# Altium schematic sheet INTERNAL_REGULATORS.SchDoc
size B; SheetNumber: 5; SheetTotal: 5
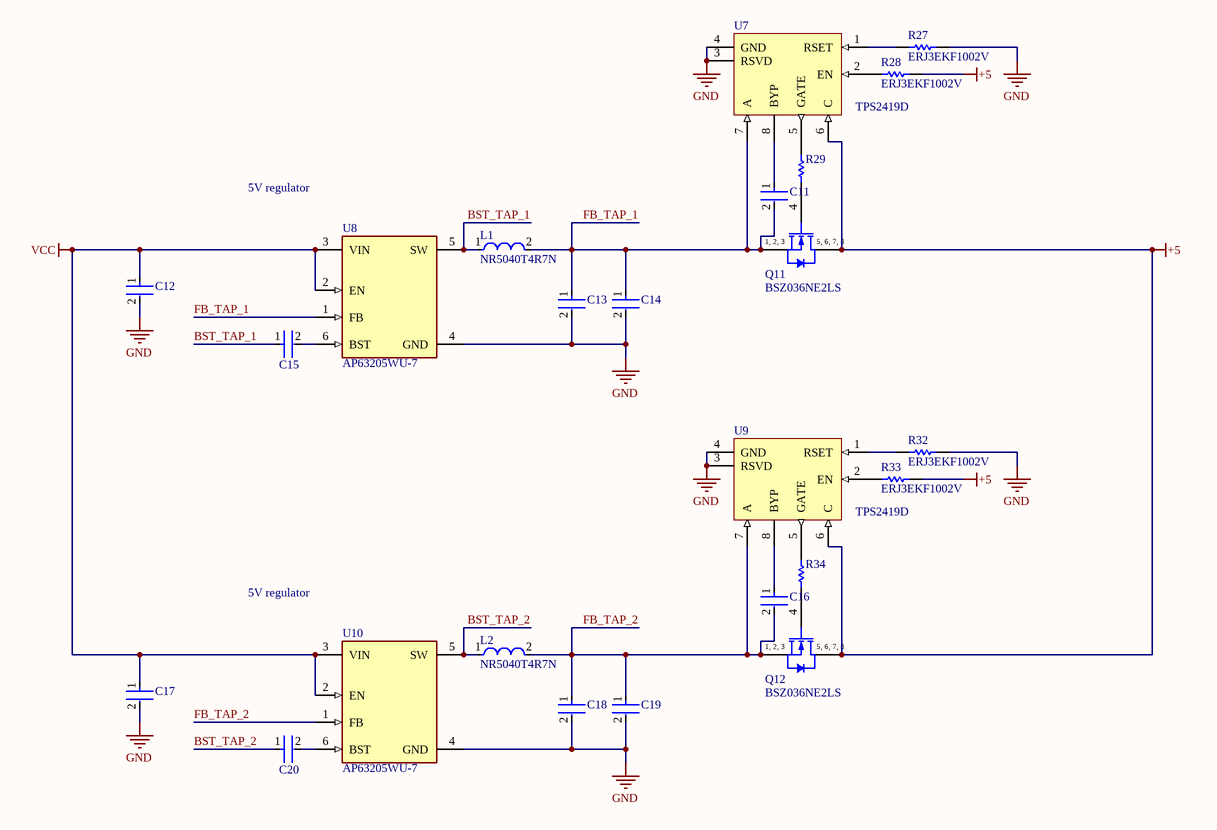
[diagram p0: INTERNAL_REGULATORS.SchDoc]

## Parts
C11  08055C222JAT2A  [FP-0805-L_2_01_0_2-W_1_25-IPC_C]  (value not drawn)
C12  C0805C106K8PACTU  [FP-C0805C-DG-MFG]  (value not drawn)
C13  GRM21BR61E226ME44L  [FP-GRM21B-0_2-e0_2_0_7-IPC_B]  (value not drawn)
C14  GRM21BR61E226ME44L  [FP-GRM21B-0_2-e0_2_0_7-IPC_B]  (value not drawn)
C15  C0402C104K8PACTU  [FP-C0402-BB-MFG]  (value not drawn)
C16  08055C222JAT2A  [FP-0805-L_2_01_0_2-W_1_25-IPC_C]  (value not drawn)
C17  C0805C106K8PACTU  [FP-C0805C-DG-MFG]  (value not drawn)
C18  GRM21BR61E226ME44L  [FP-GRM21B-0_2-e0_2_0_7-IPC_B]  (value not drawn)
C19  GRM21BR61E226ME44L  [FP-GRM21B-0_2-e0_2_0_7-IPC_B]  (value not drawn)
C20  C0402C104K8PACTU  [FP-C0402-BB-MFG]  (value not drawn)
L1  NR5040T4R7N  [FP-NR5040-H_4_1-MFG]
L2  NR5040T4R7N  [FP-NR5040-H_4_1-MFG]
Q11  BSZ036NE2LS  [INF-PG-TSDSON-8_FL_V]
Q12  BSZ036NE2LS  [INF-PG-TSDSON-8_FL_V]
R27  ERJ3EKF1002V  [RESC1609X55X30LL15T15]
R28  ERJ3EKF1002V  [RESC1609X55X30LL15T15]
R29  ERJ3EKF51R0V  [RESC1608X55X30NL15T15]  (value not drawn)
R32  ERJ3EKF1002V  [RESC1609X55X30LL15T15]
R33  ERJ3EKF1002V  [RESC1609X55X30LL15T15]
R34  ERJ3EKF51R0V  [RESC1608X55X30NL15T15]  (value not drawn)
U7  TPS2419D  [D0008A_N]
U8  AP63205WU-7  [FP-TSOT26-MFG]
U9  TPS2419D  [D0008A_N]
U10  AP63205WU-7  [FP-TSOT26-MFG]

## Nets
+5: Q11.5(DRAIN) Q11.6(DRAIN) Q11.7(DRAIN) Q11.8(DRAIN) Q12.5(DRAIN) Q12.6(DRAIN) Q12.7(DRAIN) Q12.8(DRAIN) R28.1 R33.1 U7.6(C) U9.6(C)
GND: C12.2 C13.2 C14.2 C17.2 C18.2 C19.2 R27.1 R32.1 U7.3(RSVD) U7.4(GND) U8.4(GND) U9.3(RSVD) U9.4(GND) U10.4(GND)
VCC: C12.1 C17.1 U8.2(EN) U8.3(VIN) U10.2(EN) U10.3(VIN)
BST_TAP_1: C15.1 L1.1 U8.5(SW)
BST_TAP_2: C20.1 L2.1 U10.5(SW)
FB_TAP_1: C11.2 C13.1 C14.1 L1.2 Q11.1(SOURCE) Q11.2(SOURCE) Q11.3(SOURCE) U7.7(A) U8.1(FB)
FB_TAP_2: C16.2 C18.1 C19.1 L2.2 Q12.1(SOURCE) Q12.2(SOURCE) Q12.3(SOURCE) U9.7(A) U10.1(FB)
NetC11_1: C11.1 U7.8(BYP)
NetC15_2: C15.2 U8.6(BST)
NetC16_1: C16.1 U9.8(BYP)
NetC20_2: C20.2 U10.6(BST)
NetQ11_4: Q11.4(GATE) R29.1
NetQ12_4: Q12.4(GATE) R34.1
NetR27_2: R27.2 U7.1(RSET)
NetR28_2: R28.2 U7.2(EN)
NetR29_2: R29.2 U7.5(GATE)
NetR32_2: R32.2 U9.1(RSET)
NetR33_2: R33.2 U9.2(EN)
NetR34_2: R34.2 U9.5(GATE)

## Notes on the sheet
- 5V regulator
- (in symbol CMP-1090-00125-1) 1, 2, 3; 5, 6, 7, 8

## Library data of the parts
C11 C16 = CMP-2007-04392-2: General Purpose Ceramic Capacitor, 0805, 2.2nF, 5%, X7R, 0.15, 50V; Min Operating Temperature: -55°C; Max Operating Temperature: 125°C; Construction: Flat; Voltage Rating (DC): 50V; Series: -; Case Code (Imperial): 0805; Width: 0.049inch; Mount: Surface Mount; Package Quantity: 4000; Packaging: Tape and Reel; Termination: SMD/SMT; Tolerance: 5%; Number of Pins: 2; Depth: 1.25mm; Lead Free: Lead Free; REACH SVHC: No SVHC; Contact Plating: Tin; Length: 2.01mm; Radiation Hardening: No; Capacitance: 2.2nF; Lead Pitch: 5.08mm; Thickness: 0.037inch; Dielectric: X7R; RoHS Compliant: Yes; Voltage Rating: 50V; Case Code (Metric): 2012; Height: 0.94mm; Case/Package: 0805
C12 C17 = CMP-2007-03243-2: CAP CER 10UF 10V X5R 0805; Manufacturer: Kemet; 3DS Part Number: 220-00001; Tolerance: 10%; Temperature Coefficient: 15%; Material: Ceramic; Device Class L2: Capacitors; Device Class L1: Passive Components; ComponentLink2URL: https://content.kemet.com/datasheets/KEM_C1006_X5R_SMD.pdf; Height: 1.4mm; Lead Free: Yes; Manufacturer Part Number: C0805C106K8PACTU; Digikey Description: CAP CER 10UF 10V X5R 0805; Octopart: https://octopart.com/c0805c106k8pactu-kemet-98697; Capacitance: 10uF; Value: 10uF; Temperature Range Low: -55°C; Temperature: -55°C to +85°C; Automotive: No; Mouser Description: CAP CER 10UF 10V X5R 0805; Ipc Land Pattern Name: CAPC200125X125; Temperature Range High: +85°C; Voltage: 10V; RoHS: TRUE; Device Class L3: Ceramic Capacitors; ComponentLink2Description: Datasheet; Voltage Rating: 10V; Package: C0805C-DG; Temperature Characteristic: X5R; Category: Cap
C13 C14 C18 C19 = CMP-2007-03222-3: Chip Multilayer Ceramic Capacitors for General Purpose, 0805, 22uF, X5R, 15%, 20%, 25V; Case/Package: 0805; Depth: 1.25mm; Resistor Type: Ceramic; Voltage Rating: 25V; Lead Free: Lead Free; Voltage Rating (DC): 25V; Case Code (Metric): 2012; Thickness: 0.057inch; REACH SVHC: No SVHC; Material: Ceramic; Tolerance: 20%; Length: 2mm; Capacitance: 22uF; Case Code (Imperial): 0805; Max Operating Temperature: 85°C; Termination: SMD/SMT; Weight: 0.000335oz; Dielectric: X5R; Packaging: Tape and Reel; Voltage: 25V; Package Quantity: 3000; Height: 1.25mm; Mount: Surface Mount; Width: 1.25mm; Min Operating Temperature: -55°C
C15 C20 = CMP-2008-02046-2: CAP CER 0.1UF 10V X5R 0402; Manufacturer: Kemet; Material: Ceramic; Capacitance: 0.10 μF; Temperature Coefficient: 15%; Tolerance: 0.1; Value: 0.10 μF; Package: C0402-BB; Temperature: -55°C to +125°C; ComponentLink2Description: Datasheet; Temperature Characteristic: X5R; Device Class L1: Passive Components; Height: 0.55mm; Lead Free: Yes; ComponentLink2URL: https://content.kemet.com/datasheets/KEM_C1002_X7R_SMD.pdf; Device Class L2: Capacitors; Temperature Range Low: -55°C; Temperature Range High: +125°C; RoHS: TRUE; Octopart: https://octopart.com/c0402c104k8pactu-kemet-140039; Automotive: No; Mouser Description: Capacitor 100 nF 10 VDC 0402; Category: Cap; Voltage Rating: 10 V; Digikey Description: CAP CER 0.1UF 10V X5R 0402; Ipc Land Pattern Name: CAPC10050X50; Device Class L3: Ceramic Capacitors; Manufacturer Part Number: C0402C104K8PACTU
L1 L2 = CMP-14484-001014-1: SMD Power Inductors 4.7uH ±30% 3.1A 37.7mΩ; Test Frequency: 100kHz; Self Resonant Frequency: 28MHz; DC Resistance (DCR): 37.7mR; Saturation Current: 3.3A; Shielding: Shielded; Core Material: Ferrite; Package Quantity: 1500; RoHS Compliant: Yes; Resistor Type: Wirewound; Width: 4.9mm; Termination: SMD/SMT; Number of Pins: 2; Current Rating: 3.1A; Depth: 5.1mm; RMS Current (Irms): 3.1A; Height - Seated (Max): 0.161inch; Height: 4mm; Packaging: Tape and Reel; Inductance: 4.7uH; Length: 0.193inch; Max DC Current: 3.3A; Inductance Tolerance: 30%; Case/Package: Nonstandard; Series: NR; Min Operating Temperature: -25°C; Max Operating Temperature: 120°C; Mount: Surface Mount; Radiation Hardening: No; Tolerance: 30%; Halogen Free: Halogen Free
Q11 Q12 = CMP-1090-00125-1: N-Channel OptiMOS Power-MOSFET, 25 V VDS, 40 A ID, -55 to 150 degC, PG-TSDSON-8, Reel, Green; Manufacturer: Infineon; Green: TRUE; VGS(th) (min): 1.2Â V; IDpuls (max): 160Â A; Rth: 3.4Â K/W; QG: 16Â nC; RDS (on) (max) (@4.5V): 5.1Â mOhm; VDS (max): 25Â V; ID (max): 40Â A; Ptot (max): 37Â W; RDS (on) (max): 3.6Â mOhm; VGS(th) (max): 2Â V; RthJA (max): 60 K/W; Polarity: N; Mounting Technology: Surface Mount; DatasheetVersion: Rev. 2.1; ComponentLink1Description: Manufacturer URL; ComponentLink1URL: http://www.infineon.com/; Halogen-free: TRUE; Packing: Reel; PartNumber: BSZ036NE2LS; PackageReference: PG-TSDSON-8; ComponentLink2Description: Datasheet; ComponentLink3URL: http://www.infineon.com/dgdl/DS_BSZ023N04LS_2_0_N.T..pdf?folderId=db3a304313b8b5a60113cee8763b02d7&fileId=db3a3043353fdc160135530f51f54823; PackageVersion: Rev. 02, 12/2010; PackageDescription: 8-Pin Plastic (Green) Thin Dual Small Outline Non-Leaded Package, 3.3 x 3.3 mm Body, 0.65 mm Pitch; RthJC (max): 3.4Â K/W; ComponentLink3Description: Package Specification; ComponentLink2URL: http://www.infineon.com/dgdl/BSZ036NE2LS_Rev+2.1.pdf?folderId=db3a304313b8b5a60113cee8763b02d7&fileId=db3a30432ea425a4012ed92706043869
R27 R28 R32 R33 = CMP-1012-00623-3: Chip Resistor, 10 KOhm, +/- 1%, 0.1 W, -55 to 155 degC, 0603 (1608 Metric), RoHS, Tape and Reel; Manufacturer: Panasonic; Voltage Rating: 75V; Case\/Package: 0603; Power Rating: 100mW; Resistance: 10KOhm; Temperature Coefficient: 100ppm\/degreesC; Number of Pins: 2; Package Reference: 603; Depth: 0.8mm; Mount: SurfaceMount; Package Description: 2-Pin Surface Mount Device, Body 1.6 x 0.85 mm; Datasheet Version: 02/2017; Length: 1.6mm; Lead Free: LeadFree; Height: 0.45mm; Number of Terminations: 2; Max Power Dissipation: 100mW; Min Operating Temperature: -55degC; Datasheet URL: https://industrial.panasonic.com/cdbs/www-data/pdf/RDA0000/AOA0000C304.pdf; Termination: SMD/SMT; Case Code (Metric): 1608; Case Code (Imperial): 0603; Tolerance: 1%; Max Operating Temperature: 155degC; RoHSCompliant: true; Voltage Rating (DC): 75V; Radiation Hardening: No; Packaging: TapeandReel; Composition: ThickFilm; Mounting Technology: SurfaceMount; Manufacturer URL: http://www.panasonic.com/; Width: 0.031inch; REACH SVHC: NoSVHC; Contact Plating: Tin; Military Standard: Not; Package Quantity: 1
R29 R34 = CMP-2000-00547-1: Manufacturer: Panasonic; Part Number: ERJ3EKF51R0V
U7 U9 = CMP-0334-00028-2: N+1 and ORing Power Rail Controller with Enable, 0.8 to 16.5 V, -40 to 85 degC, 8-pin SOIC (D), Green (RoHS & no Sb/Br); Manufacturer: Texas Instruments; Vin(Min)(V): 0.8; Enable (OV): Yes; Gate Control: on/off; No. of Outputs: 1; Vin(Max)(V): 16.5; Mounting Technology: Surface Mount; DatasheetVersion: SLVS998B; ComponentLink1URL: http://www.ti.com/general/docs/lit/getliterature.tsp?genericPartNumber=TPS2419&fileType=pdf; Code_JEDEC: MS-012AA; PackageReference: D0008A; Fault and Status: No; Under/Over Voltage Reporting: No; PackageVersion: revM, Jun-2011; Input Filter: No; PartNumber: TPS2419D; ComponentLink1Description: Datasheet; PackageDescription: 8-Pin Plastic Small Outline Integrated Circuit, 4.9 x 3.9 mm, Pitch 1.27 mm Pitch; Eco-Plan: Green (RoHS & no Sb/Br)
U8 U10 = CMP-12757-000001-1: IC REG BUCK 5V 2A TSOT26; Manufacturer: Diodes Inc.; Max Junction Temp: +160°C; Max Duty Cycle: 100%; Standoff Height: 0.01mm; Max Supply Voltage: 32V; Number Of Outputs: 1; Min Supply Voltage: 3.8V; Output Type: Fixed; Switching Frequency: 1100kHz; Nominal Supply Current: 22uA; Automotive: No; RoHS: TRUE; Switching Topology: Buck; Temperature: -40°C to +85°C; Footprint Url: https://www.diodes.com/assets/Package-Files/TSOT26.pdf; Lead Free: Yes; Digikey Description: IC REG BUCK 5V 2A TSOT26; Device Class L3: Voltage Regulators - Switching; Ambient Temperature Range High: +85°C; Category: IC; Package: TSOT26; Output Voltage: 5V; Output Current: 2A; ComponentLink2Description: Datasheet; Device Class L2: Power Management ICs; Ambient Temperature Range Low: -40°C; Temperature Range High: +85°C; Temperature Range Low: -40°C; Octopart: https://octopart.com/ap63205wu-7-diodes+inc.-98099551; Manufacturer Part Number: AP63205WU-7; Height: 1mm; Device Class L1: Integrated Circuits (ICs); ComponentLink2URL: https://www.diodes.com/assets/Datasheets/AP63200-AP63201-AP63203-AP63205.pdf